# Altium schematic sheet input.SchDoc
size A3
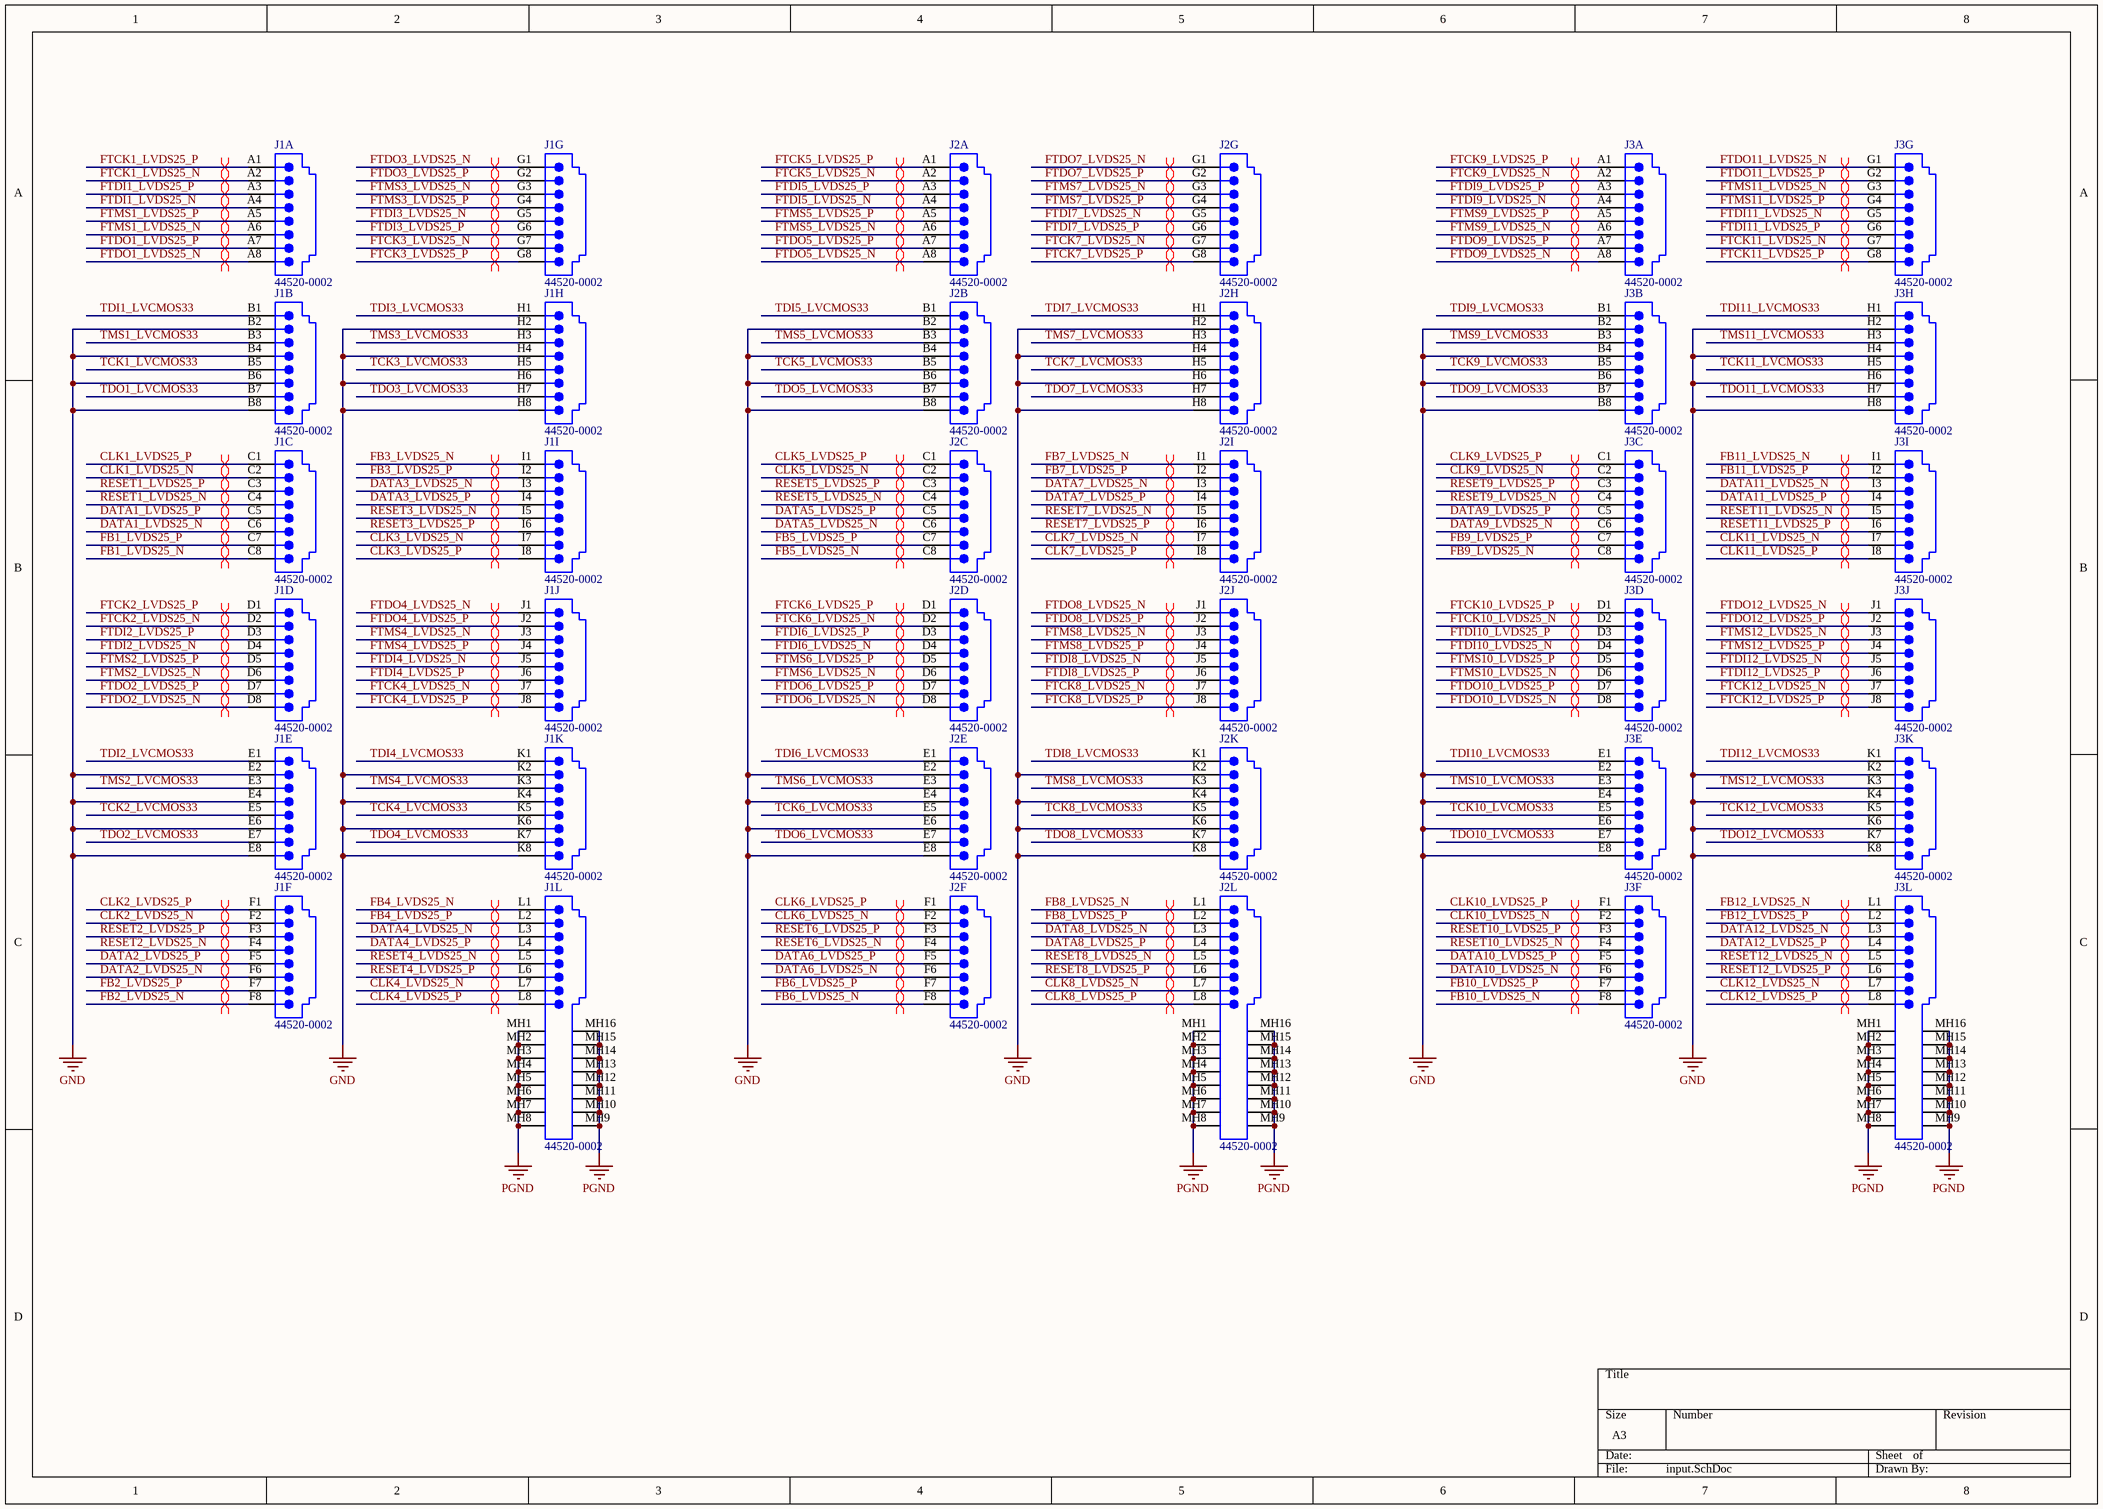
[diagram p0: input.SchDoc]

## Parts
J1  44520-0002  [44520-0002]  (parts A,B,C,D,E,F,G,H,I,J,K,L of 12)
J2  44520-0002  [44520-0002]  (parts A,B,C,D,E,F,G,H,I,J,K,L of 12)
J3  44520-0002  [44520-0002]  (parts A,B,C,D,E,F,G,H,I,J,K,L of 12)

## Nets
GND: J1.B2 J1.B4 J1.B6 J1.B8 J1.E2 J1.E4 J1.E6 J1.E8 J1.H2 J1.H4 J1.H6 J1.H8 J1.K2 J1.K4 J1.K6 J1.K8 J2.B2 J2.B4 J2.B6 J2.B8 J2.E2 J2.E4 J2.E6 J2.E8 J2.H2 J2.H4 J2.H6 J2.H8 J2.K2 J2.K4 J2.K6 J2.K8 J3.B2 J3.B4 J3.B6 J3.B8 J3.E2 J3.E4 J3.E6 J3.E8 J3.H2 J3.H4 J3.H6 J3.H8 J3.K2 J3.K4 J3.K6 J3.K8
PGND: J1.MH1(Shield) J1.MH2(Shield) J1.MH3(Shield) J1.MH4(Shield) J1.MH5(Shield) J1.MH6(Shield) J1.MH7(Shield) J1.MH8(Shield) J1.MH9(Shield) J1.MH10(Shield) J1.MH11(Shield) J1.MH12(Shield) J1.MH13(Shield) J1.MH14(Shield) J1.MH15(Shield) J1.MH16(Shield) J2.MH1(Shield) J2.MH2(Shield) J2.MH3(Shield) J2.MH4(Shield) J2.MH5(Shield) J2.MH6(Shield) J2.MH7(Shield) J2.MH8(Shield) J2.MH9(Shield) J2.MH10(Shield) J2.MH11(Shield) J2.MH12(Shield) J2.MH13(Shield) J2.MH14(Shield) J2.MH15(Shield) J2.MH16(Shield) J3.MH1(Shield) J3.MH2(Shield) J3.MH3(Shield) J3.MH4(Shield) J3.MH5(Shield) J3.MH6(Shield) J3.MH7(Shield) J3.MH8(Shield) J3.MH9(Shield) J3.MH10(Shield) J3.MH11(Shield) J3.MH12(Shield) J3.MH13(Shield) J3.MH14(Shield) J3.MH15(Shield) J3.MH16(Shield)
CLK1_LVDS25_N: J1.C2
CLK1_LVDS25_P: J1.C1
CLK2_LVDS25_N: J1.F2
CLK2_LVDS25_P: J1.F1
CLK3_LVDS25_N: J1.I7
CLK3_LVDS25_P: J1.I8
CLK4_LVDS25_N: J1.L7
CLK4_LVDS25_P: J1.L8
CLK5_LVDS25_N: J2.C2
CLK5_LVDS25_P: J2.C1
CLK6_LVDS25_N: J2.F2
CLK6_LVDS25_P: J2.F1
CLK7_LVDS25_N: J2.I7
CLK7_LVDS25_P: J2.I8
CLK8_LVDS25_N: J2.L7
CLK8_LVDS25_P: J2.L8
CLK9_LVDS25_N: J3.C2
CLK9_LVDS25_P: J3.C1
CLK10_LVDS25_N: J3.F2
CLK10_LVDS25_P: J3.F1
CLK11_LVDS25_N: J3.I7
CLK11_LVDS25_P: J3.I8
CLK12_LVDS25_N: J3.L7
CLK12_LVDS25_P: J3.L8
DATA1_LVDS25_N: J1.C6
DATA1_LVDS25_P: J1.C5
DATA2_LVDS25_N: J1.F6
DATA2_LVDS25_P: J1.F5
DATA3_LVDS25_N: J1.I3
DATA3_LVDS25_P: J1.I4
DATA4_LVDS25_N: J1.L3
DATA4_LVDS25_P: J1.L4
DATA5_LVDS25_N: J2.C6
DATA5_LVDS25_P: J2.C5
DATA6_LVDS25_N: J2.F6
DATA6_LVDS25_P: J2.F5
DATA7_LVDS25_N: J2.I3
DATA7_LVDS25_P: J2.I4
DATA8_LVDS25_N: J2.L3
DATA8_LVDS25_P: J2.L4
DATA9_LVDS25_N: J3.C6
DATA9_LVDS25_P: J3.C5
DATA10_LVDS25_N: J3.F6
DATA10_LVDS25_P: J3.F5
DATA11_LVDS25_N: J3.I3
DATA11_LVDS25_P: J3.I4
DATA12_LVDS25_N: J3.L3
DATA12_LVDS25_P: J3.L4
FB1_LVDS25_N: J1.C8
FB1_LVDS25_P: J1.C7
FB2_LVDS25_N: J1.F8
FB2_LVDS25_P: J1.F7
FB3_LVDS25_N: J1.I1
FB3_LVDS25_P: J1.I2
FB4_LVDS25_N: J1.L1
FB4_LVDS25_P: J1.L2
FB5_LVDS25_N: J2.C8
FB5_LVDS25_P: J2.C7
FB6_LVDS25_N: J2.F8
FB6_LVDS25_P: J2.F7
FB7_LVDS25_N: J2.I1
FB7_LVDS25_P: J2.I2
FB8_LVDS25_N: J2.L1
FB8_LVDS25_P: J2.L2
FB9_LVDS25_N: J3.C8
FB9_LVDS25_P: J3.C7
FB10_LVDS25_N: J3.F8
FB10_LVDS25_P: J3.F7
FB11_LVDS25_N: J3.I1
FB11_LVDS25_P: J3.I2
FB12_LVDS25_N: J3.L1
FB12_LVDS25_P: J3.L2
FTCK1_LVDS25_N: J1.A2
FTCK1_LVDS25_P: J1.A1
FTCK2_LVDS25_N: J1.D2
FTCK2_LVDS25_P: J1.D1
FTCK3_LVDS25_N: J1.G7
FTCK3_LVDS25_P: J1.G8
FTCK4_LVDS25_N: J1.J7
FTCK4_LVDS25_P: J1.J8
FTCK5_LVDS25_N: J2.A2
FTCK5_LVDS25_P: J2.A1
FTCK6_LVDS25_N: J2.D2
FTCK6_LVDS25_P: J2.D1
FTCK7_LVDS25_N: J2.G7
FTCK7_LVDS25_P: J2.G8
FTCK8_LVDS25_N: J2.J7
FTCK8_LVDS25_P: J2.J8
FTCK9_LVDS25_N: J3.A2
FTCK9_LVDS25_P: J3.A1
FTCK10_LVDS25_N: J3.D2
FTCK10_LVDS25_P: J3.D1
FTCK11_LVDS25_N: J3.G7
FTCK11_LVDS25_P: J3.G8
FTCK12_LVDS25_N: J3.J7
FTCK12_LVDS25_P: J3.J8
FTDI1_LVDS25_N: J1.A4
FTDI1_LVDS25_P: J1.A3
FTDI2_LVDS25_N: J1.D4
FTDI2_LVDS25_P: J1.D3
FTDI3_LVDS25_N: J1.G5
FTDI3_LVDS25_P: J1.G6
FTDI4_LVDS25_N: J1.J5
FTDI4_LVDS25_P: J1.J6
FTDI5_LVDS25_N: J2.A4
FTDI5_LVDS25_P: J2.A3
FTDI6_LVDS25_N: J2.D4
FTDI6_LVDS25_P: J2.D3
FTDI7_LVDS25_N: J2.G5
FTDI7_LVDS25_P: J2.G6
FTDI8_LVDS25_N: J2.J5
FTDI8_LVDS25_P: J2.J6
FTDI9_LVDS25_N: J3.A4
FTDI9_LVDS25_P: J3.A3
FTDI10_LVDS25_N: J3.D4
FTDI10_LVDS25_P: J3.D3
FTDI11_LVDS25_N: J3.G5
FTDI11_LVDS25_P: J3.G6
FTDI12_LVDS25_N: J3.J5
FTDI12_LVDS25_P: J3.J6
FTDO1_LVDS25_N: J1.A8
FTDO1_LVDS25_P: J1.A7
FTDO2_LVDS25_N: J1.D8
FTDO2_LVDS25_P: J1.D7
FTDO3_LVDS25_N: J1.G1
FTDO3_LVDS25_P: J1.G2
FTDO4_LVDS25_N: J1.J1
FTDO4_LVDS25_P: J1.J2
FTDO5_LVDS25_N: J2.A8
FTDO5_LVDS25_P: J2.A7
FTDO6_LVDS25_N: J2.D8
FTDO6_LVDS25_P: J2.D7
FTDO7_LVDS25_N: J2.G1
FTDO7_LVDS25_P: J2.G2
FTDO8_LVDS25_N: J2.J1
FTDO8_LVDS25_P: J2.J2
FTDO9_LVDS25_N: J3.A8
FTDO9_LVDS25_P: J3.A7
FTDO10_LVDS25_N: J3.D8
FTDO10_LVDS25_P: J3.D7
FTDO11_LVDS25_N: J3.G1
FTDO11_LVDS25_P: J3.G2
FTDO12_LVDS25_N: J3.J1
FTDO12_LVDS25_P: J3.J2
FTMS1_LVDS25_N: J1.A6
FTMS1_LVDS25_P: J1.A5
FTMS2_LVDS25_N: J1.D6
FTMS2_LVDS25_P: J1.D5
FTMS3_LVDS25_N: J1.G3
FTMS3_LVDS25_P: J1.G4
FTMS4_LVDS25_N: J1.J3
FTMS4_LVDS25_P: J1.J4
FTMS5_LVDS25_N: J2.A6
FTMS5_LVDS25_P: J2.A5
FTMS6_LVDS25_N: J2.D6
FTMS6_LVDS25_P: J2.D5
FTMS7_LVDS25_N: J2.G3
FTMS7_LVDS25_P: J2.G4
FTMS8_LVDS25_N: J2.J3
FTMS8_LVDS25_P: J2.J4
FTMS9_LVDS25_N: J3.A6
FTMS9_LVDS25_P: J3.A5
FTMS10_LVDS25_N: J3.D6
FTMS10_LVDS25_P: J3.D5
FTMS11_LVDS25_N: J3.G3
FTMS11_LVDS25_P: J3.G4
FTMS12_LVDS25_N: J3.J3
FTMS12_LVDS25_P: J3.J4
RESET1_LVDS25_N: J1.C4
RESET1_LVDS25_P: J1.C3
RESET2_LVDS25_N: J1.F4
RESET2_LVDS25_P: J1.F3
RESET3_LVDS25_N: J1.I5
RESET3_LVDS25_P: J1.I6
RESET4_LVDS25_N: J1.L5
RESET4_LVDS25_P: J1.L6
RESET5_LVDS25_N: J2.C4
RESET5_LVDS25_P: J2.C3
RESET6_LVDS25_N: J2.F4
RESET6_LVDS25_P: J2.F3
RESET7_LVDS25_N: J2.I5
RESET7_LVDS25_P: J2.I6
RESET8_LVDS25_N: J2.L5
RESET8_LVDS25_P: J2.L6
RESET9_LVDS25_N: J3.C4
RESET9_LVDS25_P: J3.C3
RESET10_LVDS25_N: J3.F4
RESET10_LVDS25_P: J3.F3
RESET11_LVDS25_N: J3.I5
RESET11_LVDS25_P: J3.I6
RESET12_LVDS25_N: J3.L5
RESET12_LVDS25_P: J3.L6
TCK1_LVCMOS33: J1.B5
TCK2_LVCMOS33: J1.E5
TCK3_LVCMOS33: J1.H5
TCK4_LVCMOS33: J1.K5
TCK5_LVCMOS33: J2.B5
TCK6_LVCMOS33: J2.E5
TCK7_LVCMOS33: J2.H5
TCK8_LVCMOS33: J2.K5
TCK9_LVCMOS33: J3.B5
TCK10_LVCMOS33: J3.E5
TCK11_LVCMOS33: J3.H5
TCK12_LVCMOS33: J3.K5
TDI1_LVCMOS33: J1.B1
TDI2_LVCMOS33: J1.E1
TDI3_LVCMOS33: J1.H1
TDI4_LVCMOS33: J1.K1
TDI5_LVCMOS33: J2.B1
TDI6_LVCMOS33: J2.E1
TDI7_LVCMOS33: J2.H1
TDI8_LVCMOS33: J2.K1
TDI9_LVCMOS33: J3.B1
TDI10_LVCMOS33: J3.E1
TDI11_LVCMOS33: J3.H1
TDI12_LVCMOS33: J3.K1
TDO1_LVCMOS33: J1.B7
TDO2_LVCMOS33: J1.E7
TDO3_LVCMOS33: J1.H7
TDO4_LVCMOS33: J1.K7
TDO5_LVCMOS33: J2.B7
TDO6_LVCMOS33: J2.E7
TDO7_LVCMOS33: J2.H7
TDO8_LVCMOS33: J2.K7
TDO9_LVCMOS33: J3.B7
TDO10_LVCMOS33: J3.E7
TDO11_LVCMOS33: J3.H7
TDO12_LVCMOS33: J3.K7
TMS1_LVCMOS33: J1.B3
TMS2_LVCMOS33: J1.E3
TMS3_LVCMOS33: J1.H3
TMS4_LVCMOS33: J1.K3
TMS5_LVCMOS33: J2.B3
TMS6_LVCMOS33: J2.E3
TMS7_LVCMOS33: J2.H3
TMS8_LVCMOS33: J2.K3
TMS9_LVCMOS33: J3.B3
TMS10_LVCMOS33: J3.E3
TMS11_LVCMOS33: J3.H3
TMS12_LVCMOS33: J3.K3

## Layout directives
differential pair: CLK1_LVDS25_N, CLK1_LVDS25_P, CLK2_LVDS25_N, CLK2_LVDS25_P, CLK3_LVDS25_N, CLK3_LVDS25_P, CLK4_LVDS25_N, CLK4_LVDS25_P, CLK5_LVDS25_N, CLK5_LVDS25_P, CLK6_LVDS25_N, CLK6_LVDS25_P, CLK7_LVDS25_N, CLK7_LVDS25_P, CLK8_LVDS25_N, CLK8_LVDS25_P, CLK9_LVDS25_N, CLK9_LVDS25_P, CLK10_LVDS25_N, CLK10_LVDS25_P, CLK11_LVDS25_N, CLK11_LVDS25_P, CLK12_LVDS25_N, CLK12_LVDS25_P, DATA1_LVDS25_N, DATA1_LVDS25_P, DATA2_LVDS25_N, DATA2_LVDS25_P, DATA3_LVDS25_N, DATA3_LVDS25_P, DATA4_LVDS25_N, DATA4_LVDS25_P, DATA5_LVDS25_N, DATA5_LVDS25_P, DATA6_LVDS25_N, DATA6_LVDS25_P, DATA7_LVDS25_N, DATA7_LVDS25_P, DATA8_LVDS25_N, DATA8_LVDS25_P, DATA9_LVDS25_N, DATA9_LVDS25_P, DATA10_LVDS25_N, DATA10_LVDS25_P, DATA11_LVDS25_N, DATA11_LVDS25_P, DATA12_LVDS25_N, DATA12_LVDS25_P, FB1_LVDS25_N, FB1_LVDS25_P, FB2_LVDS25_N, FB2_LVDS25_P, FB3_LVDS25_N, FB3_LVDS25_P, FB4_LVDS25_N, FB4_LVDS25_P, FB5_LVDS25_N, FB5_LVDS25_P, FB6_LVDS25_N, FB6_LVDS25_P, FB7_LVDS25_N, FB7_LVDS25_P, FB8_LVDS25_N, FB8_LVDS25_P, FB9_LVDS25_N, FB9_LVDS25_P, FB10_LVDS25_N, FB10_LVDS25_P, FB11_LVDS25_N, FB11_LVDS25_P, FB12_LVDS25_N, FB12_LVDS25_P, FTCK1_LVDS25_N, FTCK1_LVDS25_P, FTCK2_LVDS25_N, FTCK2_LVDS25_P, FTCK3_LVDS25_N, FTCK3_LVDS25_P, FTCK4_LVDS25_N, FTCK4_LVDS25_P, FTCK5_LVDS25_N, FTCK5_LVDS25_P, FTCK6_LVDS25_N, FTCK6_LVDS25_P, FTCK7_LVDS25_N, FTCK7_LVDS25_P, FTCK8_LVDS25_N, FTCK8_LVDS25_P, FTCK9_LVDS25_N, FTCK9_LVDS25_P, FTCK10_LVDS25_N, FTCK10_LVDS25_P, FTCK11_LVDS25_N, FTCK11_LVDS25_P, FTCK12_LVDS25_N, FTCK12_LVDS25_P, FTDI1_LVDS25_N, FTDI1_LVDS25_P, FTDI2_LVDS25_N, FTDI2_LVDS25_P, FTDI3_LVDS25_N, FTDI3_LVDS25_P, FTDI4_LVDS25_N, FTDI4_LVDS25_P, FTDI5_LVDS25_N, FTDI5_LVDS25_P, FTDI6_LVDS25_N, FTDI6_LVDS25_P, FTDI7_LVDS25_N, FTDI7_LVDS25_P, FTDI8_LVDS25_N, FTDI8_LVDS25_P, FTDI9_LVDS25_N, FTDI9_LVDS25_P, FTDI10_LVDS25_N, FTDI10_LVDS25_P, FTDI11_LVDS25_N, FTDI11_LVDS25_P, FTDI12_LVDS25_N, FTDI12_LVDS25_P, FTDO1_LVDS25_N, FTDO1_LVDS25_P, FTDO2_LVDS25_N, FTDO2_LVDS25_P, FTDO3_LVDS25_N, FTDO3_LVDS25_P, FTDO4_LVDS25_N, FTDO4_LVDS25_P, FTDO5_LVDS25_N, FTDO5_LVDS25_P, FTDO6_LVDS25_N, FTDO6_LVDS25_P, FTDO7_LVDS25_N, FTDO7_LVDS25_P, FTDO8_LVDS25_N, FTDO8_LVDS25_P, FTDO9_LVDS25_N, FTDO9_LVDS25_P, FTDO10_LVDS25_N, FTDO10_LVDS25_P, FTDO11_LVDS25_N, FTDO11_LVDS25_P, FTDO12_LVDS25_N, FTDO12_LVDS25_P, FTMS1_LVDS25_N, FTMS1_LVDS25_P, FTMS2_LVDS25_N, FTMS2_LVDS25_P, FTMS3_LVDS25_N, FTMS3_LVDS25_P, FTMS4_LVDS25_N, FTMS4_LVDS25_P, FTMS5_LVDS25_N, FTMS5_LVDS25_P, FTMS6_LVDS25_N, FTMS6_LVDS25_P, FTMS7_LVDS25_N, FTMS7_LVDS25_P, FTMS8_LVDS25_N, FTMS8_LVDS25_P, FTMS9_LVDS25_N, FTMS9_LVDS25_P, FTMS10_LVDS25_N, FTMS10_LVDS25_P, FTMS11_LVDS25_N, FTMS11_LVDS25_P, FTMS12_LVDS25_N, FTMS12_LVDS25_P, RESET1_LVDS25_N, RESET1_LVDS25_P, RESET2_LVDS25_N, RESET2_LVDS25_P, RESET3_LVDS25_N, RESET3_LVDS25_P, RESET4_LVDS25_N, RESET4_LVDS25_P, RESET5_LVDS25_N, RESET5_LVDS25_P, RESET6_LVDS25_N, RESET6_LVDS25_P, RESET7_LVDS25_N, RESET7_LVDS25_P, RESET8_LVDS25_N, RESET8_LVDS25_P, RESET9_LVDS25_N, RESET9_LVDS25_P, RESET10_LVDS25_N, RESET10_LVDS25_P, RESET11_LVDS25_N, RESET11_LVDS25_P, RESET12_LVDS25_N, RESET12_LVDS25_P

## Library data of the parts
J1-J3 = 44520-0002: High Speed, Stacked, Multi-Port, Right Angle, Snap-Fit, Shielded, Modular Jack; Ports: 12; Positions/Loaded: All Ports - 8/8; PerformanceCategory: 5; PCB_Mounting: Thru-Hole; DrillSize: Nominal, Rounded to nearest 0.05mm; PCB_Layout: Complies with Manufacturer's Recommendation.; Published: 25-Jun-2002; DatasheetDocument: 13-Dec-2001; PackageDocument: 13-Dec-2001; PackageReference: 44520-0002; Publisher: Altium Limited; ComponentLink1Description: Manufacturer Link; ComponentLink1URL: http://www.molex.com/; ComponentLink2Description: Datasheet; ComponentLink2URL: http://www.molex.com/cmc_upload/common_files/1212003_mx44520.pdf; ComponentLink3Description: Iges Model; ComponentLink3URL: http://www.molex.com/pdm_docs/igs/44520-0001_igs.zip